# EAGLE design Prototipo3 (EAGLE 6.1)
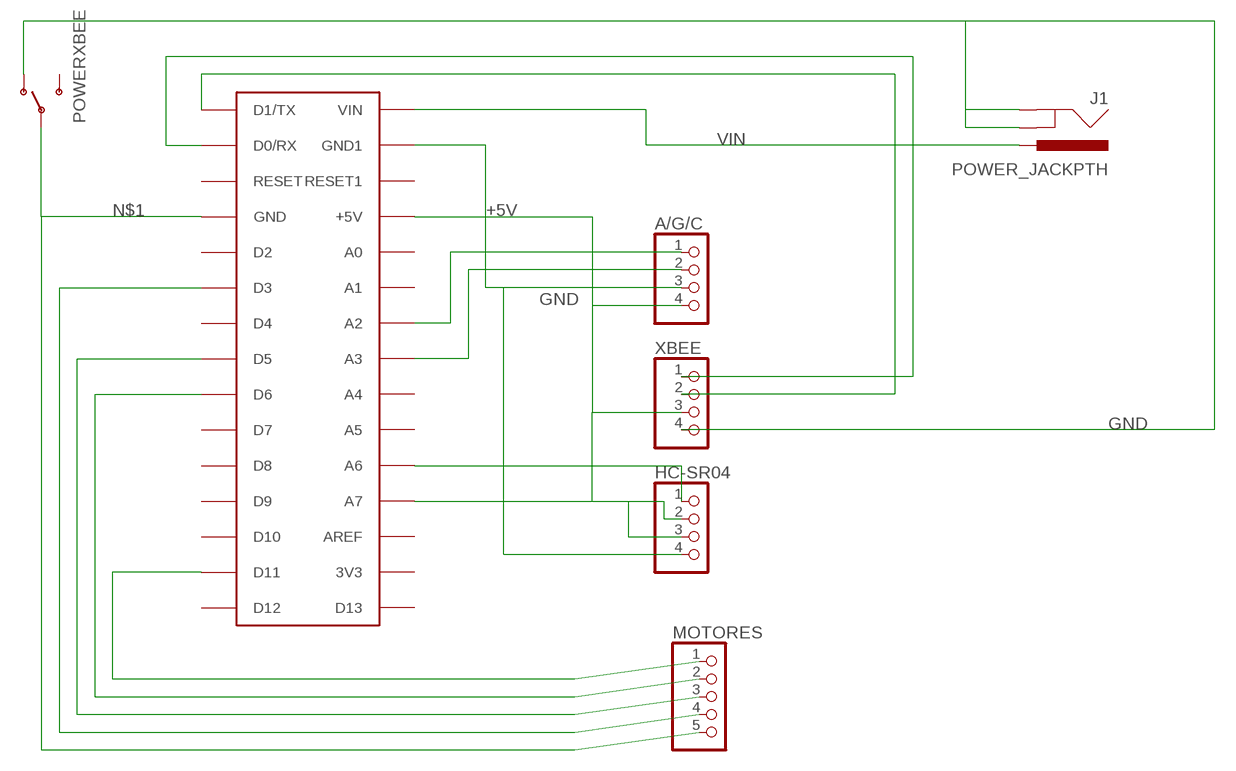
[diagram p0: schematic, sheet 1]

## Parts
A/G/C  PINHD-1X4/90  [1X04/90]
HC-SR04  PINHD-1X4  [1X04]
J1  POWER_JACKPTH  [POWER_JACK_PTH]
MOTORES  PINHD-1X5  [1X05]
POWERXBEE  SWITCH-SPDTPTH  [SWITCH-SPDT]
U$1  ARDUINONANO  [PDIP-32]
XBEE  PINHD-1X4  [1X04]

## Nets
+5V: A/G/C.4 HC-SR04.3 U$1.+5V XBEE.3
GND: A/G/C.3 HC-SR04.4 J1.GND J1.GNDBREAK POWERXBEE.1(O) U$1.GND1 XBEE.4
N$1: MOTORES.5 POWERXBEE.2(P) U$1.GND
N$2: MOTORES.4 U$1.D3
N$3: MOTORES.3 U$1.D5
N$4: MOTORES.2 U$1.D6
N$5: MOTORES.1 U$1.D11
N$6: HC-SR04.1 U$1.A6
N$7: HC-SR04.2 U$1.A7
N$9: A/G/C.1 U$1.A2
N$10: A/G/C.2 U$1.A3
N$11: U$1.D1/TX XBEE.2
N$12: U$1.D0/RX XBEE.1
VIN: J1.PWR U$1.VIN
Unconnected: POWERXBEE.3(S) U$1.3V3 U$1.A0 U$1.A1 U$1.A4 U$1.A5 U$1.AREF U$1.D2 U$1.D4 U$1.D7 U$1.D8 U$1.D9 U$1.D10 U$1.D12 U$1.D13 U$1.RESET U$1.RESET1

## Library data of the parts
A/G/C HC-SR04 XBEE = pinhead:PINHD-1X4: PIN HEADER
J1 = SparkFun-Connectors:POWER_JACK: Power Jack This is the standard 5.5mm barrel jack for power. The PTH is the most common, proven, reliable, footprint. The Slot footprint only works if the mill layer is transmitted to the PCB fab house so be warned. Mating wall wart : TOL-00298 (and others); PROD_ID: PRT-00119
MOTORES = pinhead:PINHD-1X5: PIN HEADER
POWERXBEE = SparkFun-Electromechanical:SWITCH-SPDT: SPDT Switch Simple slide switch, Spark Fun Electronics SKU : COM-00102 DPDT SMT slide switch, AYZ0202, SWCH-08179
U$1 = jet-lib:ARDUINONANO

## Board
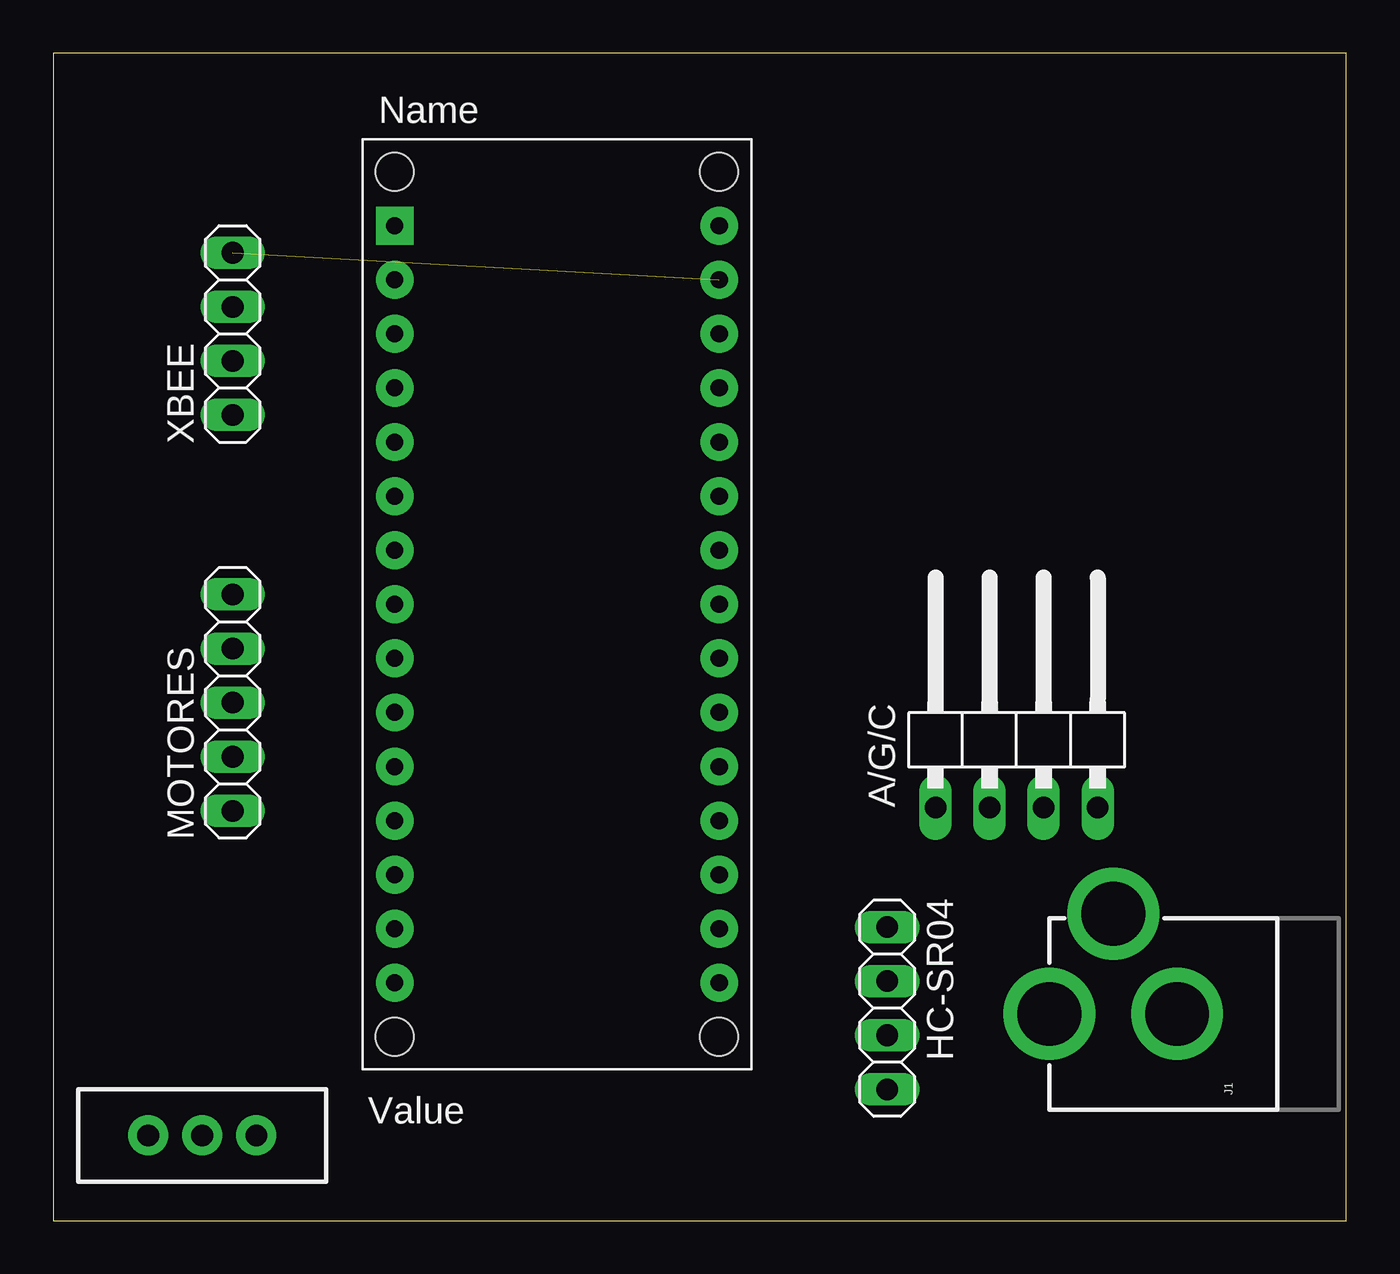
[diagram p1: board, top side]
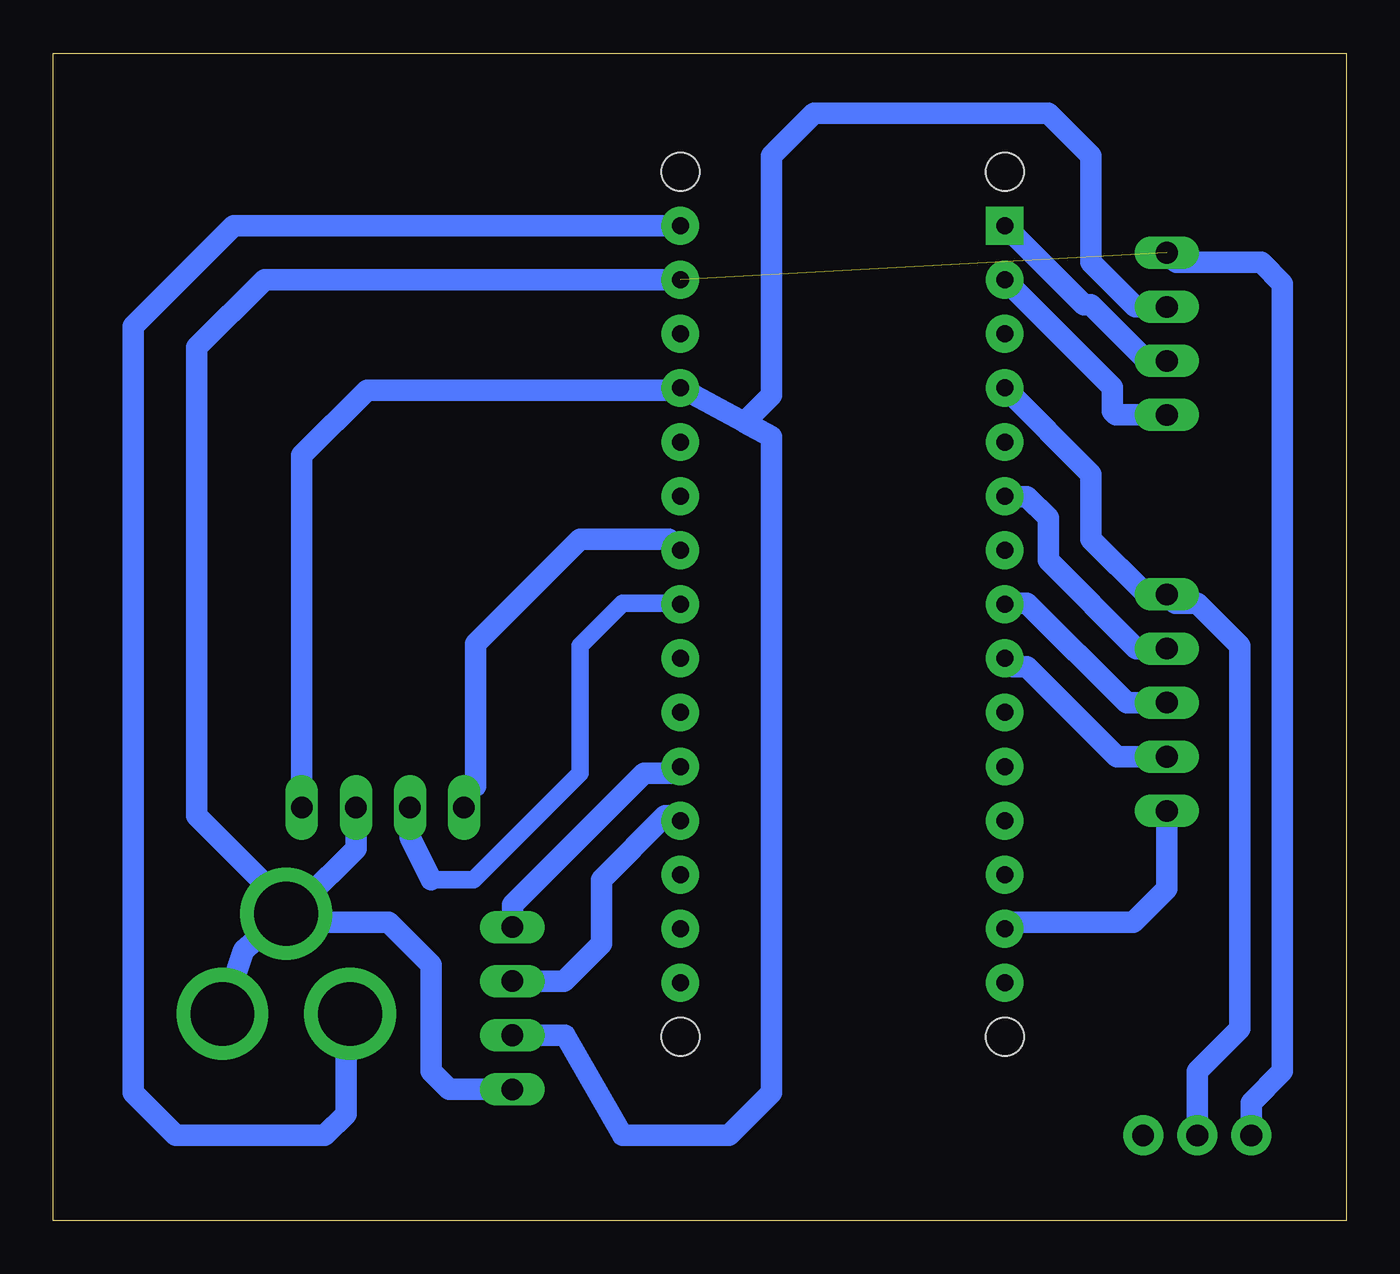
[diagram p2: board, bottom side, seen from below]

Size 60.75 x 54.82 mm. Coordinates in mm from the lower left corner, seen from the top.
Outline: 0,0 60.75,0 60.75,54.82 0,54.82 0,0
Copper layers (1*16): Top 0.035mm / dielectric 1.5mm / Bottom 0.035mm
Design rules: minimum track width 10mil, minimum drill 24mil, track to track 8mil, track to pad 8mil, pad to pad 8mil, via to via 8mil, smd to smd 8mil, copper to edge 40mil, drill to drill 8mil, minimum pad ring 10mil, minimum via ring 8mil, stop-mask expansion 4mil, vias tented up to drill 0mil, thermal gap 10mil

### Footprints (pad centres in the part's own frame; a part is rotated, then mirrored left to right if it is on the bottom)
1X04/90 = drill 1.016 long: 1 -3.81,-3.81; 2 -1.27,-3.81; 3 1.27,-3.81; 4 3.81,-3.81
1X04 = drill 1.016 long: 1 -3.81,0; 2 -1.27,0; 3 1.27,0; 4 3.81,0
POWER_JACK_PTH = drill 2.997 pad 4.318: GND 0,7.7; GNDBREAK 4.7,10.7; PWR 0,13.7
1X05 = drill 1.016 long: 1 -5.08,0; 2 -2.54,0; 3 0,0; 4 2.54,0; 5 5.08,0
SWITCH-SPDT = drill 1.016 pad 1.88: 1 0,2.54; 2 0,0; 3 0,-2.54
PDIP-32 = drill 0.8 pad 1.778: 3V3 15.24,-35.56; +5V 15.24,-10.16; A0 15.24,-12.7; A1 15.24,-15.24; A2 15.24,-17.78; A3 15.24,-20.32; A4 15.24,-22.86; A5 15.24,-25.4; A6 15.24,-27.94; A7 15.24,-30.48; AREF 15.24,-33.02; D0/RX 0,-5.08; D2 0,-12.7; D3 0,-15.24; D4 0,-17.78; D5 0,-20.32; D6 0,-22.86; D7 0,-25.4; D8 0,-27.94; D9 0,-30.48; D10 0,-33.02; D11 0,-35.56; D12 0,-38.1; D13 15.24,-38.1; GND 0,-10.16; GND1 15.24,-5.08; RESET 0,-7.62; RESET1 15.24,-7.62; VIN 15.24,-2.54 | drill 0.8 pad 1.778 square: D1/TX 0,-2.54 | hole 1.778: 0,0; 0,-40.64; 15.24,-40.64; 15.24,0

### Placement (x,y rotation side)
A/G/C  45.26,23.21 0 top
HC-SR04  39.18,9.97 270 top
J1  60.5,9.7 90 top
MOTORES  8.43,24.32 90 top
POWERXBEE  7,4 90 top
U$1  16.05,49.26 0 top
XBEE  8.43,41.64 90 top

### Tracks (layer width: path | path; a pad name or v marks a point on that pad's centre or on a via)
+5V
  Bottom 0.254: 31.75,39.1 U$1.+5V 30.48,39.1
  Bottom 1.016: HC-SR04.3 36.7,8.7 34,4 29,4 27,6 27,36.81 28.27,37.49 | 28.27,37.49 U$1.+5V 31.39,39 46,39 49.07,35.93 A/G/C.4 | XBEE.3 9.91,42.91 12,45 12,50 14,52 25,52 27,50 27,38.76 28.27,37.49
GND  (1 unrouted)
  Bottom 0.254: 45.99,19.4 A/G/C.3
  Bottom 1.016: J1.GNDBREAK 51.8,12.7 J1.GND | POWERXBEE.1 4.46,5.54 3,7 3,44 4,45 7.98,45 XBEE.4 | U$1.GND1 50.82,44.18 54,41 54,19 50,15 50,14.6 J1.GNDBREAK | HC-SR04.4 42.16,6.16 43,7 43,12 45,14 49.4,14 J1.GNDBREAK | A/G/C.3 46.53,17.47 49,15 49.2,15 J1.GNDBREAK
N$1
  Bottom 0.254: 16.51,39.1 U$1.GND
  Bottom 1.016: U$1.GND 12,35.05 12,32 9.4,29.4 MOTORES.5 8.03,29 7,29 5,27 5,9 7,7 POWERXBEE.2
N$2
  Bottom 1.016: MOTORES.4 9.86,26.86 14,31 14,33 15,34 16.03,34 U$1.D3
N$3
  Bottom 1.016: MOTORES.3 10.32,24.32 15,29 15.99,29 U$1.D5
N$4
  Bottom 1.016: MOTORES.2 10.78,21.78 15,26 15.65,26 U$1.D6
N$5
  Bottom 1.016: MOTORES.1 8.43,15.57 10,14 15.75,14 U$1.D11
N$6
  Bottom 1.016: HC-SR04.1 39.18,14.82 33,21 31.61,21 U$1.A6
N$7
  Bottom 1.016: HC-SR04.2 36.76,11.24 35,13 35,16 32,19 31.51,19 U$1.A7
N$9
  Bottom 0.254: 40.91,20.4 A/G/C.1
  Bottom 1.016: 40.91,20.4 40.91,27.09 36,32 31.81,32 U$1.A2
N$10
  Bottom 0.61: A/G/C.2 43.99,17.99 | 31.35,29 U$1.A3
  Bottom 0.813: 31.35,29 34,29 36,27 36,21 41,16 43,16
  Bottom 1.016: 43.99,17.99 43,16
N$11
  Bottom 1.016: XBEE.2 9.37,40.37 12,43 12.33,43 U$1.D1/TX
N$12
  Bottom 0.254: 16.51,44.18 U$1.D0/RX
  Bottom 1.016: XBEE.1 10.83,37.83 11,38 11,39.13 U$1.D0/RX
VIN
  Bottom 1.016: U$1.VIN 52.28,46.72 57,42 57,6 55,4 48,4 47,5 47,9.5 J1.PWR